# Altium project SE842170260.PRJPCB (part 1 of 2)
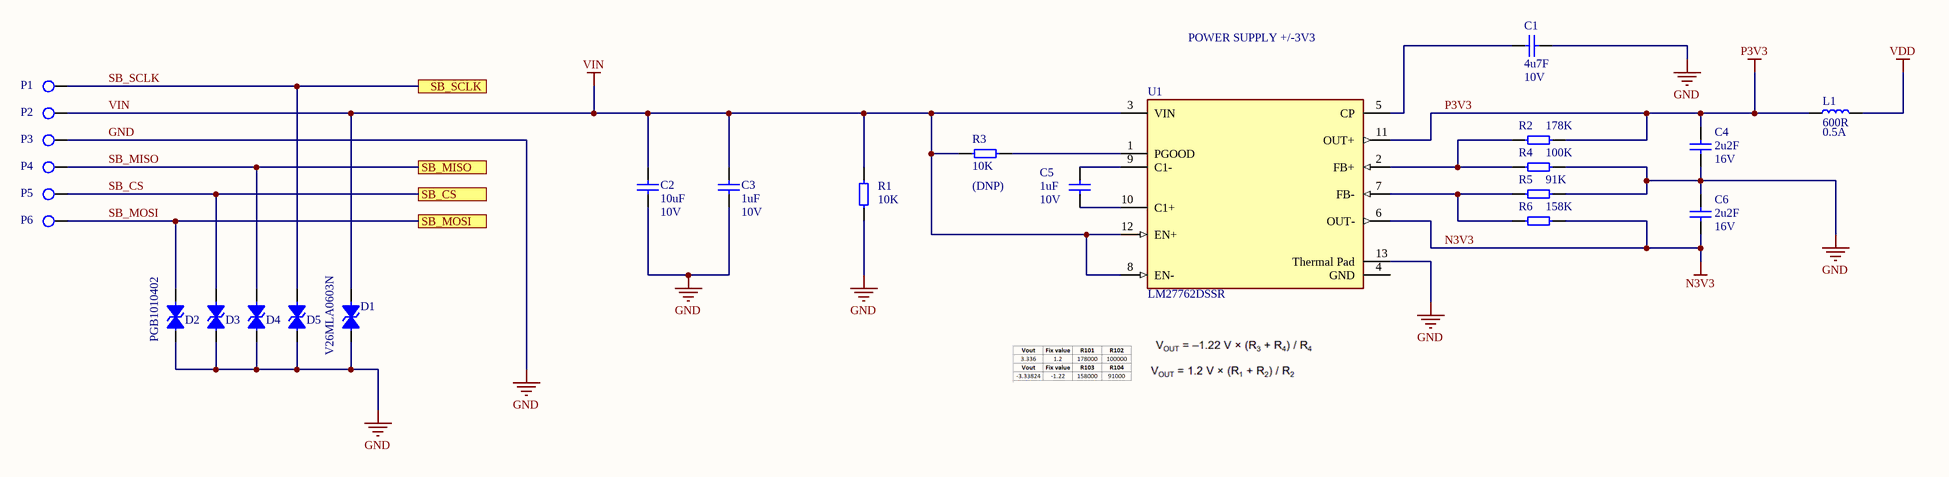
[diagram p0: CE842170260_SHEET1.SchDoc]
P_CircuitDiagramPartNumber: CE/YYYYY/ZZZZ; P_CircuitDiagramSafeFileName: CEYYYYYZZZZ; P_DesignedBy: Designer Name; P_DesignedDate: yyyy-mm-dd; P_Detail: Project Detai;; P_Mod: 1; P_Organization: Baker Hughes PPS; P_PCBAssemblyPartNumber: SE/YYYYY/ZZZZ; P_PCBAssemblySafeFileName: SEYYYYYZZZZ; P_PCBManufacturingPartNumber: DE/YYYYY/ZZZZ; P_PCBManufacturingSafeFileName: DEYYYYYZZZZ; P_Rev: 1; P_Title: Project Title
6 sheets, 204 parts. Net scope: flat (ports and power ports of the same name join across sheets).
Board file: DE842170260.PcbDoc
Sheets:
  CE842170260_SHEET1.SchDoc
  CE842170260_SHEET2.SchDoc
  CE842170260_SHEET3.SchDoc
  CE842170260_SHEET4.SchDoc
  CE842170260_SHEET5.SchDoc
  CE842170260_SHEET6.SchDoc

## Sheet CE842170260_SHEET1.SchDoc
size Tabloid; Revision: P; SheetNumber: 1; SheetTotal: 1; PageSetup: Record=PageOptions|CenterHorizontal=True|CenterVertical=True|PrintScale=0.75|XCorrection=1.00|YCorrection=1.00|PrintKind=0|BorderSize=5000000|LeftOffset=0|BottomOffset=0|Orientation=2|PaperLength=1000|PaperWidth=1000|Scale=100|PaperSource=7|PrintQuality=-4|MediaType=1|DitherType=10|PaperKind=A4|PrintScaleMode=1; Rule: PcbType=ProtelPcb

### Parts
C1  value 4u7F  Voltage: 10V  [C0603]  (hidden comment: KK/96159/2666)
C2  value 10uF  Voltage: 10V  [C0603]  (hidden comment: KK/96159/3701)
C3  value 1uF  Voltage: 10V  [C0603]  (hidden comment: KK/96159/2601)
C4  value 2u2F  Voltage: 16V  [C0603]  (hidden comment: KK/96159/3634)
C5  value 1uF  Voltage: 10V  [C0603]  (hidden comment: KK/96159/2601)
C6  value 2u2F  Voltage: 16V  [C0603]  (hidden comment: KK/96159/3634)
D1  MF_PartNumber: V26MLA0603N  [R0603]  (hidden comment: KK/95070/0035)
D2  MF_PartNumber: PGB1010402  [ESD0402]  (hidden comment: KK/95070/0036)
D3  KK/95070/0036  [ESD0402]  (value not drawn)
D4  KK/95070/0036  [ESD0402]  (value not drawn)
D5  KK/95070/0036  [ESD0402]  (value not drawn)
L1  value 600R  Power: 0.5A  [L0603]  (hidden comment: KK/97900/1033)
P1  TESTPAD1  [P0.8xH0.5]  (value not drawn)
P2  TESTPAD1  [P0.8xH0.5]  (value not drawn)
P3  TESTPAD1  [P0.8xH0.5]  (value not drawn)
P4  TESTPAD1  [P0.8xH0.5]  (value not drawn)
P5  TESTPAD1  [P0.8xH0.5]  (value not drawn)
P6  TESTPAD1  [P0.8xH0.5]  (value not drawn)
R1  value 10K  [R0603]  (hidden comment: KK/96059/0601)
R2  value 178K  [R0603]  (hidden comment: KK/96059/0725)
R3  value 10K  [R0603]  (hidden comment: KK/96059/0601)
R4  value 100K  [R0603]  (hidden comment: KK/96059/0701)
R5  value 91K  [R0603]  (hidden comment: KK/96059/1693)
R6  value 158K  [R0603]  (hidden comment: KK/96059/0720)
U1  MF_PartNumber: LM27762DSSR  [WSON-12]  (hidden comment: KK/95311/0117)

### Ports
SB_CS, SB_MISO, SB_MOSI, SB_SCLK

### Nets
GND: C1.2 C2.2 C3.2 C4.2 C6.1 D1.1 D2.1 D3.1 D4.1 D5.1 P3.1 R1.2 R4.2 R5.2 U1.13(Thermal_Pad)
N3V3: C6.2 R6.2 U1.6(OUT-)
P3V3: C4.1 L1.1 R2.2 U1.11(OUT+)
SB_SCLK: C2.1 C3.1 D1.2 D5.2 P1.1 P2.1 R1.1 R3.1 U1.3(VIN) U1.8(EN-) U1.12(EN+) ; port SB_SCLK  [also labelled VIN]
VDD: L1.2
SB_CS: D3.2 P5.1 ; port SB_CS
SB_MISO: D4.2 P4.1 ; port SB_MISO
SB_MOSI: D2.2 P6.1 ; port SB_MOSI
NetC1_1: C1.1 U1.5(CP)
NetC5_1: C5.1 U1.9(C1-)
NetC5_2: C5.2 U1.10(C1+)
NetR2_1: R2.1 R4.1 U1.2(FB+)
NetR3_2: R3.2 U1.1(PGOOD)
NetR5_1: R5.1 R6.1 U1.7(FB-)

Not connected (* = marked no-connect by the designer): U1 4(GND)

### Notes on the sheet
- POWER SUPPLY +/-3V3
- (near R3) (DNP)
- Title:
- Designed:
- Date:
- PROPRIETARY & CONFIDENTIAL
- DO NOT COPY, WHOLE OR IN PART.
- Detail:
- Number:
- Rev:
- Checked:
- DO NOT DISTRIBUTE WITHOUT WRITTEN CONSENT.
- File:
- Sheet:
- of
- Approved:

### Library data of the parts
C1 = KK/96159/2666: CAPACITOR_4u7F_10%_10V_0603; ID: 165; Tolerance: 10%; PII_PartNumber: KK/96159/2666; Pins: 2
C2 = KK/96159/3701: CAPACITOR_10uF_10%_10V_0603; ID: 175; Tolerance: 10%; PII_PartNumber: KK/96159/3701; Pins: 2
C3 C5 = KK/96159/2601: CAPACITOR_1uF_+10%_10V_603; ID: 164; Tolerance: 10%; PII_PartNumber: KK/96159/2601; Pins: 2
C4 C6 = KK/96159/3634: CAPACITOR CERAMIC 0603 16V 10% X5R 2u2; ID: 569; PII_PartNumber: KK/96159/3634; Pins: 2; Tolerance: 10%
D1 = KK/95070/0035: TVS,SMD,LITTLEFUSE,V26MLA0603N[20-26V]; ID: 261; Voltage: 26V; Value: 34.5V; PII_PartNumber: KK/95070/0035; Pins: 2; Manufacturer: LITTLEFUSE; Temperature: -55°C +125°C
D2-D5 = KK/95070/0036: SUPPRESSOR ESD,SMD,0402,12VDC,LIF,PGB1010402; Manufacturer: LITTELFUSE; ID: 262; Voltage: 12V; PII_PartNumber: KK/95070/0036; Pins: 2
  D3-D5: MF_PartNumber: PGB1010402
L1 = KK/97900/1033: FERRIT BEADS 0603 600R 0.5A 25%; MF_PartNumber: 742863160; Manufacturer: WUERTH; ID: 158; PII_PartNumber: KK/97900/1033; Pins: 2; Tolerance: 25%; Temperature: -55 to +125C
P1-P6 = TESTPAD1: P0.8 X H0.5 X 0.9SM; Manufacturer: PCB MANUFACTURER; ID: 26; PII_PartNumber: TESTPAD1; MF_PartNumber: P0.8 X H0.5 X 0.9SM; Pins: 1
R1 R3 = KK/96059/0601: RESISTOR_10K_1%_0603J_63mW; ID: 1090; Tolerance: 1%; Power: 63mW; PII_PartNumber: KK/96059/0601; Pins: 2
R2 = KK/96059/0725: RESISTOR 0603 0.063W 0.1% 178K; ID: 1402; PII_PartNumber: KK/96059/0725; Pins: 2; Tolerance: 0.1%; Power: 0.063W
R4 = KK/96059/0701: RESISTOR_100K_1%_0603J_63mW; ID: 1111; Tolerance: 1%; Power: 63mW; PII_PartNumber: KK/96059/0701; Pins: 2
R5 = KK/96059/1693: RESISTOR 0603 0.063W 1% 91K; ID: 1396; PII_PartNumber: KK/96059/1693; Pins: 2; Tolerance: 1%; Power: 0.063W
R6 = KK/96059/0720: RESISTOR_158K_1%_0603J_63mW; ID: 1118; Tolerance: 1%; Power: 63mW; PII_PartNumber: KK/96059/0720; Pins: 2
U1 = KK/95311/0117: SWITCHING REGULATOR; Manufacturer: TEXAS INSTRUMENTS; Topology: Charge Pump; Min Output Voltage: 1.5V; Max Input Voltage: 5.5V; Synchronous Rectifier: No; Output Type: Adjustable; Output Current: 250mA; Min Input Voltage: 2.7V; Quiescent Current: 390uA; Switching Frequency: 2.3MHz; Max Output Voltage: 5V; ID: 104; Voltage: 2.7-5.5V; Lead Free: Lead Free; Min Operating Temperature: -40°C; Max Operating Temperature: 85°C; RoHS Compliant: Yes; Packaging: Tape and Reel; Mount: Surface Mount; Manufacturer Part Number: LM27762DSSR; PII_PartNumber: KK/95311/0117; Pins: 12; Power: 250mA; Temperature: -40 to +85C

## Sheet CE842170260_SHEET2.SchDoc
size Tabloid; Revision: P; SheetNumber: 1; SheetTotal: 1; PageSetup: Record=PageOptions|CenterHorizontal=True|CenterVertical=True|PrintScale=0.75|XCorrection=1.00|YCorrection=1.00|PrintKind=0|BorderSize=5000000|LeftOffset=0|BottomOffset=0|Orientation=2|PaperLength=1000|PaperWidth=1000|Scale=100|PaperSource=7|PrintQuality=-4|MediaType=1|DitherType=10|PaperKind=A4|PrintScaleMode=1; Rule: PcbType=ProtelPcb
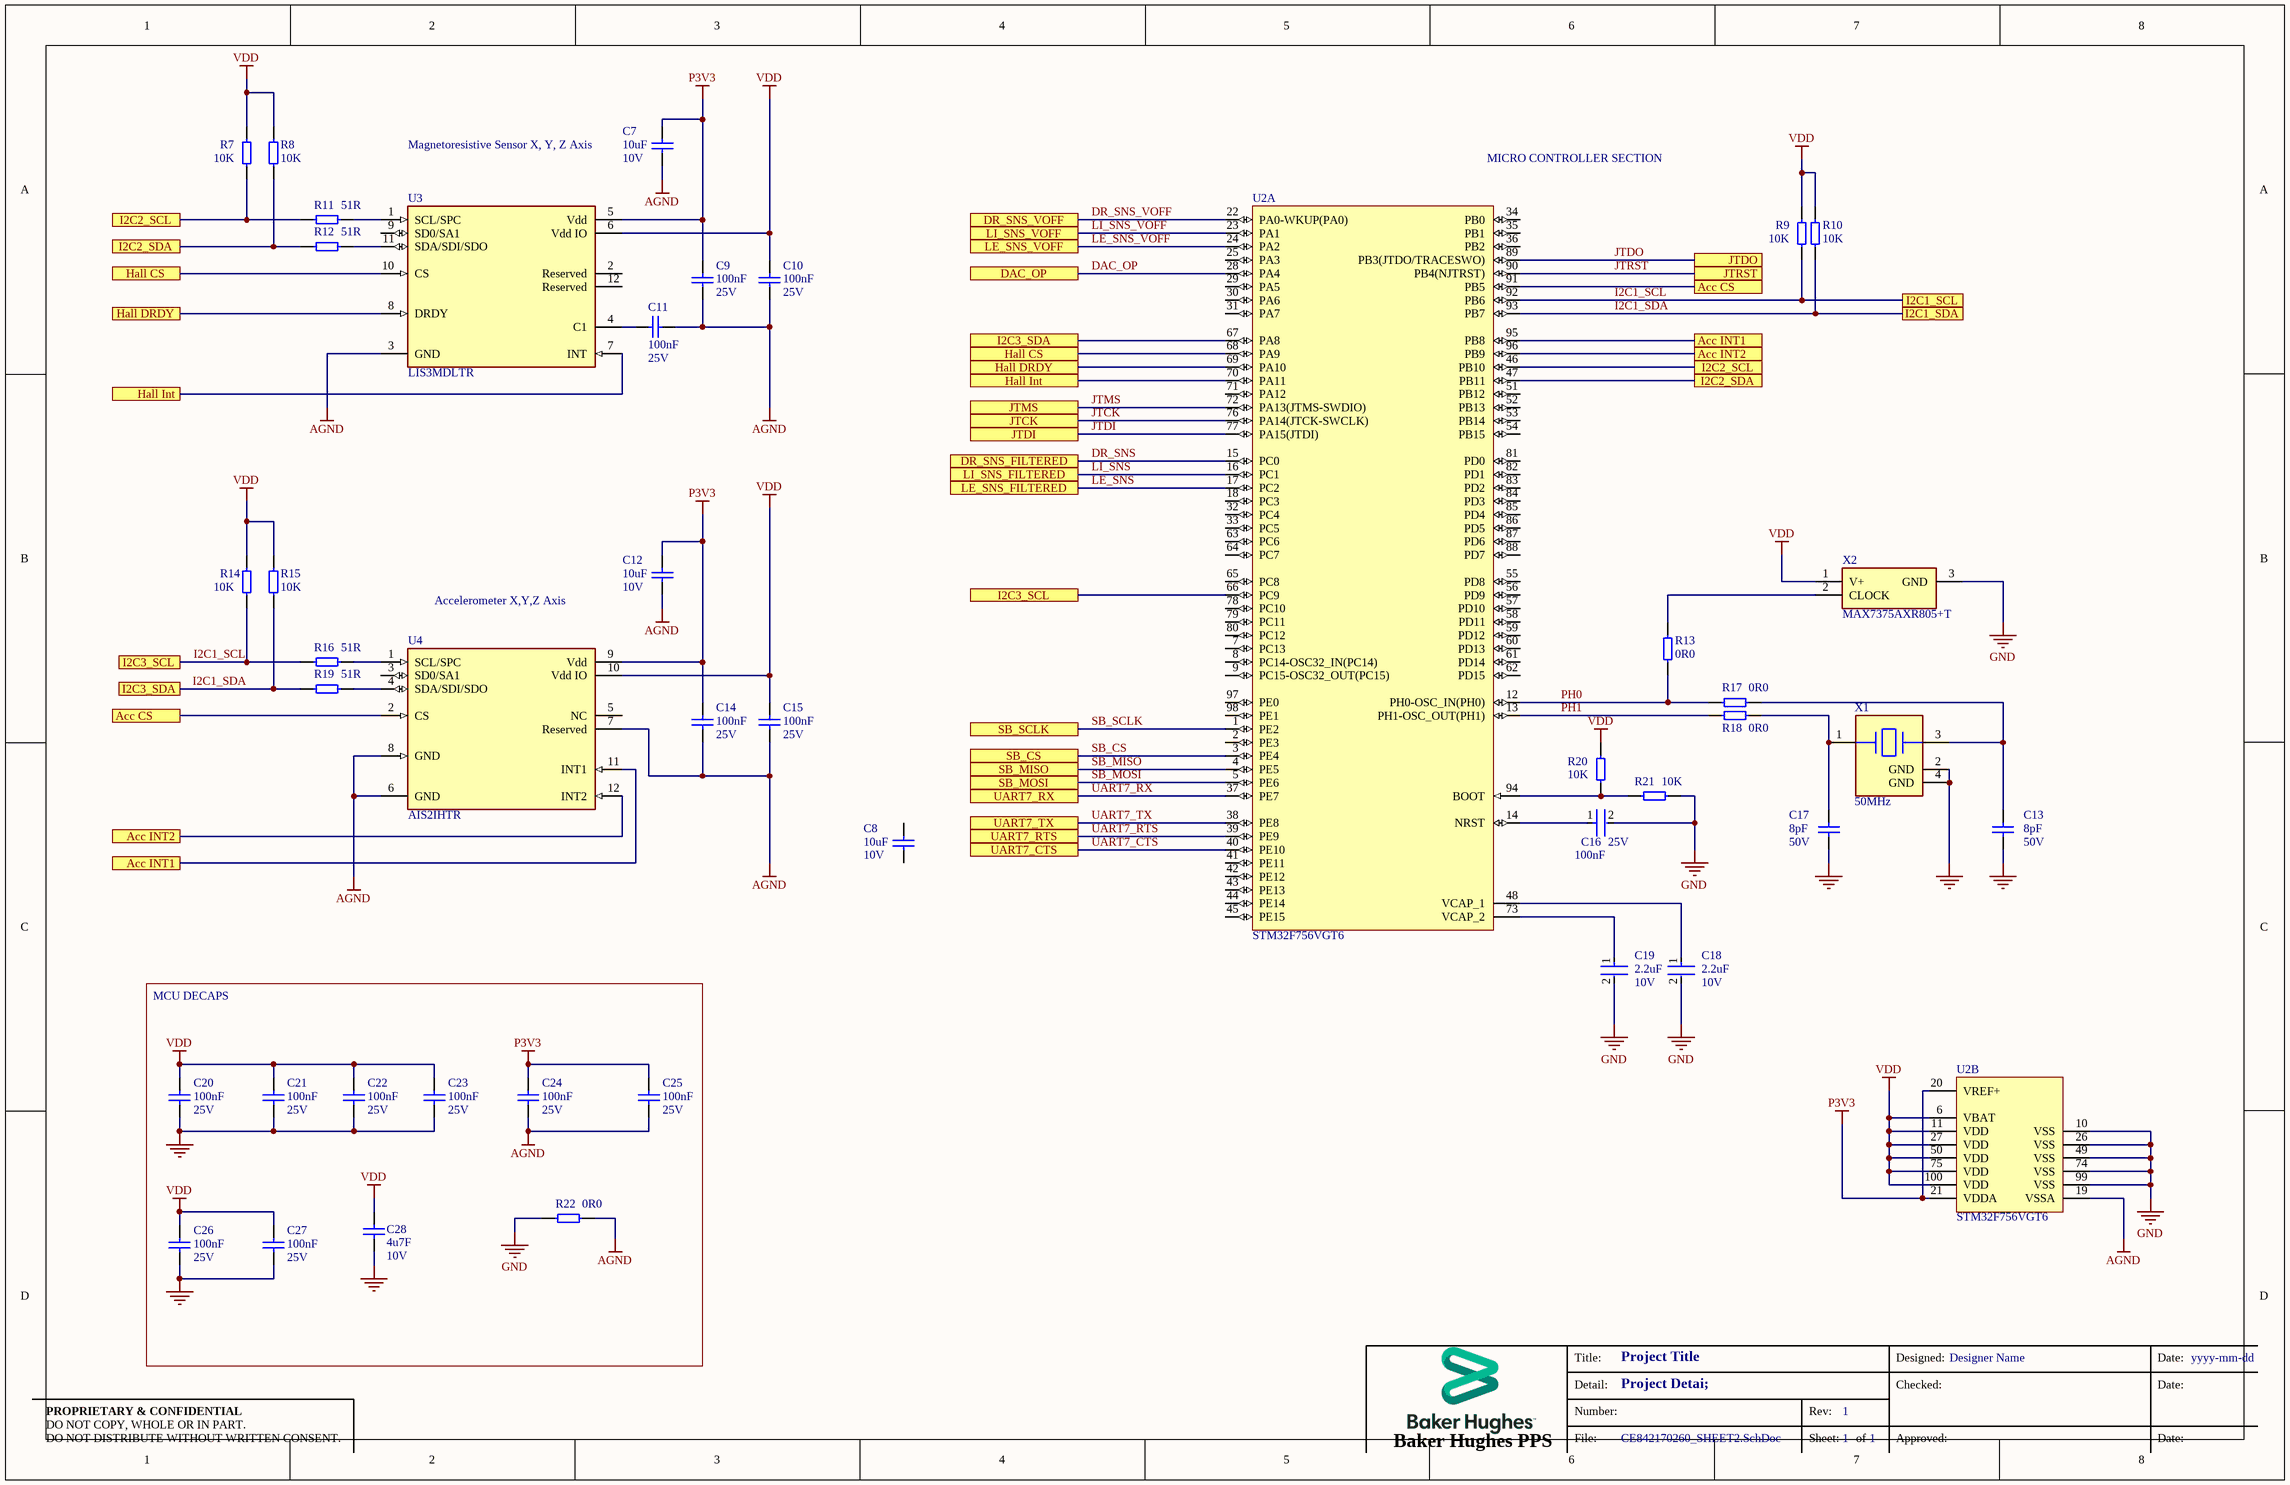
[diagram p1: CE842170260_SHEET2.SchDoc]

### Parts
C7  value 10uF  Voltage: 10V  [C0603]  (hidden comment: KK/96159/3701)
C8  value 10uF  Voltage: 10V  [C0603]  (hidden comment: KK/96159/3701)
C9  value 100nF  Voltage: 25V  [C0603]  (hidden comment: KK/96159/4501)
C10  value 100nF  Voltage: 25V  [C0603]  (hidden comment: KK/96159/4501)
C11  value 100nF  Voltage: 25V  [C0603]  (hidden comment: KK/96159/4501)
C12  value 10uF  Voltage: 10V  [C0603]  (hidden comment: KK/96159/3701)
C13  value 8pF  Voltage: 50V  [C0603]  (hidden comment: KK/96159/0088)
C14  value 100nF  Voltage: 25V  [C0603]  (hidden comment: KK/96159/4501)
C15  value 100nF  Voltage: 25V  [C0603]  (hidden comment: KK/96159/4501)
C16  Voltage Rating (DC): 25V  Capacitance: 100nF  [FP-C1005-050-0_05-MFG]  (hidden comment: C1005X5R1E104K050BC)
C17  value 8pF  Voltage: 50V  [C0603]  (hidden comment: KK/96159/0088)
C18  Voltage Rating: 10V  Capacitance: 2.2uF  [FP-CGB3B-IPC_A]  (hidden comment: CGB3B3X5R1A225M055AB)
C19  Voltage Rating: 10V  Capacitance: 2.2uF  [FP-CGB3B-IPC_A]  (hidden comment: CGB3B3X5R1A225M055AB)
C20  value 100nF  Voltage: 25V  [C0603]  (hidden comment: KK/96159/4501)
C21  value 100nF  Voltage: 25V  [C0603]  (hidden comment: KK/96159/4501)
C22  value 100nF  Voltage: 25V  [C0603]  (hidden comment: KK/96159/4501)
C23  value 100nF  Voltage: 25V  [C0603]  (hidden comment: KK/96159/4501)
C24  value 100nF  Voltage: 25V  [C0603]  (hidden comment: KK/96159/4501)
C25  value 100nF  Voltage: 25V  [C0603]  (hidden comment: KK/96159/4501)
C26  value 100nF  Voltage: 25V  [C0603]  (hidden comment: KK/96159/4501)
C27  value 100nF  Voltage: 25V  [C0603]  (hidden comment: KK/96159/4501)
C28  value 4u7F  Voltage: 10V  [C0603]  (hidden comment: KK/96159/2666)
R7  value 10K  [R0603]  (hidden comment: KK/96059/0601)
R8  value 10K  [R0603]  (hidden comment: KK/96059/0601)
R9  value 10K  [R0603]  (hidden comment: KK/96059/0601)
R10  value 10K  [R0603]  (hidden comment: KK/96059/0601)
R11  value 51R  [R0603]  (hidden comment: KK/96059/1369)
R12  value 51R  [R0603]  (hidden comment: KK/96059/1369)
R13  value 0R0  [R0603]  (hidden comment: KK/96059/0000)
R14  value 10K  [R0603]  (hidden comment: KK/96059/0601)
R15  value 10K  [R0603]  (hidden comment: KK/96059/0601)
R16  value 51R  [R0603]  (hidden comment: KK/96059/1369)
R17  value 0R0  [R0603]  (hidden comment: KK/96059/0000)
R18  value 0R0  [R0603]  (hidden comment: KK/96059/0000)
R19  value 51R  [R0603]  (hidden comment: KK/96059/1369)
R20  value 10K  [R0603]  (hidden comment: KK/96059/0601)
R21  value 10K  [R0603]  (hidden comment: KK/96059/0601)
R22  value 0R0  [R0603]  (hidden comment: KK/96059/0000)
U2  MF_PartNumber: STM32F756VGT6  [LQFP-100]  (hidden comment: KK/95414/0147)  (parts A,B of 2)
U3  MF_PartNumber: LIS3MDLTR  [LGA-12]  (hidden comment: KK/95312/0195)
U4  MF_PartNumber: AIS2IHTR  [LGA-12]  (hidden comment: KK/95312/0196)
X1  Frequency: 50MHz  [FP-NX1612SA-MFG]  (hidden comment: NX1612SA-50M-EXS00A-CS08403)
X2  MAX7375AXR805+T  [SOT65P210X110-3N]

### Blocks framed on the sheet
MCU DECAPS: C20-C28 R22

### Ports
Acc CS, Acc INT1, Acc INT2, DAC_OP, DR_SNS_FILTERED, DR_SNS_VOFF, Hall CS, Hall DRDY, Hall Int, I2C1_SCL, I2C1_SDA, I2C2_SCL, I2C2_SDA, I2C3_SCL, I2C3_SDA, JTCK, JTDI, JTDO, JTMS, JTRST, LE_SNS_FILTERED, LE_SNS_VOFF, LI_SNS_FILTERED, LI_SNS_VOFF, SB_CS, SB_MISO, SB_MOSI, SB_SCLK, UART7_CTS, UART7_RTS, UART7_RX, UART7_TX

### Nets
AGND: C7.2 C9.2 C10.2 C11.2 C12.2 C14.2 C15.2 C24.2 C25.2 R22.2 U2.19(VSSA) U3.3(GND) U4.6(GND) U4.7(Reserved) U4.8(GND)
GND: C13.1 C16.2 C17.2 C18.2 C19.2 C20.2 C21.2 C22.2 C23.2 C26.2 C27.2 C28.2 R21.1 R22.1 U2.10(VSS) U2.26(VSS) U2.49(VSS) U2.74(VSS) U2.99(VSS) X1.2(GND) X1.4(GND) X2.3(GND)
P3V3: C7.1 C9.1 C12.1 C14.1 C24.1 C25.1 U2.20(VREF+) U2.21(VDDA) U3.5(Vdd) U4.9(Vdd)
SB_SCLK: U2.1(PE2) ; port SB_SCLK
VDD: C10.1 C15.1 C20.1 C21.1 C22.1 C23.1 C26.1 C27.1 C28.1 R7.2 R8.2 R9.2 R10.2 R14.2 R15.2 R20.2 U2.6(VBAT) U2.11(VDD) U2.27(VDD) U2.50(VDD) U2.75(VDD) U2.100(VDD) U3.6(Vdd_IO) U4.10(Vdd_IO) X2.1(V+)
DAC_OP: R10.1 R15.1 R19.1 U2.28(PA4) U2.67(PA8) U2.91(PB5) U2.93(PB7) U4.2(CS) ; port DAC_OP, port I2C1_SDA, port Acc CS, port I2C3_SDA  [also labelled I2C1_SDA]  [project net DAC OP]
DR_SNS: U2.15(PC0) ; port DR_SNS_FILTERED
DR_SNS_VOFF: R7.1 R11.1 U2.22(PA0-WKUP(PA0)) U2.46(PB10) ; port DR_SNS_VOFF, port I2C2_SCL
I2C1_SCL: R9.1 R14.1 R16.1 U2.66(PC9) U2.92(PB6) ; port I2C1_SCL, port I2C3_SCL  [project net DR_SNS]
JTCK: U2.76(PA14(JTCK-SWCLK)) ; port JTCK
JTDI: U2.77(PA15(JTDI)) ; port JTDI
JTDO: U2.89(PB3(JTDO/TRACESWO)) ; port JTDO
JTMS: U2.72(PA13(JTMS-SWDIO)) ; port JTMS
JTRST: U2.90(PB4(NJTRST)) ; port JTRST
LE_SNS: U2.68(PA9) U3.10(CS) ; port Hall CS
LE_SNS: U2.17(PC2) ; port LE_SNS_FILTERED  [a separate net that carries the same name]
LE_SNS_VOFF: R8.1 R12.1 U2.24(PA2) U2.47(PB11) ; port LE_SNS_VOFF, port I2C2_SDA
LI_SNS: U2.16(PC1) ; port LI_SNS_FILTERED
LI_SNS_VOFF: U2.23(PA1) U2.69(PA10) U3.8(DRDY) ; port LI_SNS_VOFF, port Hall DRDY
PH0: R13.2 R17.1 U2.12(PH0-OSC_IN(PH0))
PH1: R18.1 U2.13(PH1-OSC_OUT(PH1))
SB_CS: U2.3(PE4) ; port SB_CS
SB_MISO: U2.4(PE5) ; port SB_MISO
SB_MOSI: U2.5(PE6) ; port SB_MOSI
UART7_CTS: U2.40(PE10) ; port UART7_CTS
UART7_RTS: U2.39(PE9) ; port UART7_RTS
UART7_RX: U2.37(PE7) ; port UART7_RX
UART7_TX: U2.38(PE8) ; port UART7_TX
NetC11_1: C11.1 U3.4(C1)
NetC13_2: C13.2 R17.2 X1.3(2_Xtal)
NetC16_1: C16.1 U2.14(NRST)
NetC17_1: C17.1 R18.2 X1.1(1_Xtal)
NetC18_1: C18.1 U2.48(VCAP_1)
NetC19_1: C19.1 U2.73(VCAP_2)
NetJ8_5: U2.70(PA11) U3.7(INT) ; port Hall Int
NetJ10_4: U2.95(PB8) U4.11(INT1) ; port Acc INT1
NetJ10_5: U2.96(PB9) U4.12(INT2) ; port Acc INT2
NetR11_2: R11.2 U3.1(SCL/SPC)
NetR12_2: R12.2 U3.11(SDA/SDI/SDO)
NetR13_1: R13.1 X2.2(CLOCK)
NetR16_2: R16.2 U4.1(SCL/SPC)
NetR19_2: R19.2 U4.4(SDA/SDI/SDO)
NetR20_1: R20.1 R21.2 U2.94(BOOT)

Not connected (* = marked no-connect by the designer): C8 1 2; U2 2(PE3) 7(PC13) 8(PC14-OSC32_IN(PC14)) 9(PC15-OSC32_OUT(PC15)) 18(PC3) 25(PA3) 29(PA5) 30(PA6) 31(PA7) 32(PC4) 33(PC5) 34(PB0) 35(PB1) 36(PB2) 41(PE11) 42(PE12) 43(PE13) 44(PE14) 45(PE15) 51(PB12) 52(PB13) 53(PB14) 54(PB15) 55(PD8) 56(PD9) 57(PD10) 58(PD11) 59(PD12) 60(PD13) 61(PD14) 62(PD15) 63(PC6) 64(PC7) 65(PC8) 71(PA12) 78(PC10) 79(PC11) 80(PC12) 81(PD0) 82(PD1) 83(PD2) 84(PD3) 85(PD4) 86(PD5) 87(PD6) 88(PD7) 97(PE0) 98(PE1); U3 2(Reserved) 9(SD0/SA1) 12(Reserved); U4 3(SD0/SA1) 5(NC)

### Notes on the sheet
- (near C7) Magnetoresistive Sensor X, Y, Z Axis
- MICRO CONTROLLER SECTION
- Accelerometer X,Y,Z Axis
- Title:
- Designed:
- Date:
- PROPRIETARY & CONFIDENTIAL
- DO NOT COPY, WHOLE OR IN PART.
- Detail:
- Number:
- Rev:
- Checked:
- DO NOT DISTRIBUTE WITHOUT WRITTEN CONSENT.
- File:
- Sheet:
- of
- Approved:

### Library data of the parts
C7 C8 C12 = KK/96159/3701: as C2 on sheet CE842170260_SHEET1; PII_PartNumber: KK/96159/3701; Pins: 2
C9-C11 C14 C15 C20-C27 = KK/96159/4501: CAPACITOR_100nF_+10%_25V_603; ID: 185; Tolerance: 10%; PII_PartNumber: KK/96159/4501; Pins: 2
C13 C17 = KK/96159/0088: CAPACITOR CERAMIC 0603 50V 5% NPO 8pF; ID: 570; PII_PartNumber: KK/96159/0088; Pins: 2; Tolerance: 5%
C16 = CMP-2000-06000-2: Multilayer Ceramic Capacitors 100nF ±10% 25V X5R SMD 0402; Case Code (Imperial): 0402; Termination: Wraparound; Series: C; Depth: 0.5mm; Contact Plating: Tin; Case Code (Metric): 1005; Dielectric: X5R; Case/Package: 0402; Voltage Rating: 25V; Packaging: Tape and Reel; Thickness: 0.022inch; Dielectric Material: Ceramic; Height: 0.5mm; Weight: 2.3E-05oz; RoHS Compliant: Yes; Width: 0.02inch; Tolerance: 10%; Mount: Surface Mount; Package Quantity: 1; Max Operating Temperature: 85°C; Construction: Flat; Min Operating Temperature: -55°C; REACH SVHC: No SVHC; Resistor Type: Ceramic; Length: 1mm; Lead Free: Lead Free; Voltage: 25V
C18 C19 = CMP-08246-006382-1: Multilayer Ceramic Capacitors 2.2uF ±20% 10V X5R SMD 0603; Max Operating Temperature: 85°C; Length: 1.6mm; Case Code (Imperial): 0603; Termination: SMD/SMT; Weight: 7.1E-05oz; Mount: Surface Mount; Depth: 0.8mm; Packaging: Tape and Reel; RoHS Compliant: Yes; Series: CGB; Voltage Rating (DC): 10V; Dielectric: X5R; Case/Package: 0603; Case Code (Metric): 1608; Height: 0.55mm; Min Operating Temperature: -55°C; Thickness: 0.022inch; Tolerance: 20%; Width: 0.8mm; Package Quantity: 1; Lead Free: Lead Free
C28 = KK/96159/2666: as C1 on sheet CE842170260_SHEET1; PII_PartNumber: KK/96159/2666; Pins: 2
R7-R10 R14 R15 R20 R21 = KK/96059/0601: as R1 on sheet CE842170260_SHEET1; PII_PartNumber: KK/96059/0601; Pins: 2
R11 R12 R16 R19 = KK/96059/1369: RESISTOR_51R_1%_0603J_63mW; ID: 1148; Tolerance: 1%; Power: 63mW; Temp_Coeff: 100ppm; PII_PartNumber: KK/96059/1369; Pins: 2
R13 R17 R18 R22 = KK/96059/0000: ZERO OHM LINK; ID: 7; Power: 63mW; PII_PartNumber: KK/96059/0000; Pins: 2
U2 = KK/95414/0147: MICROCONTROLLER MCU; Manufacturer: STMICROELECTRONICS; Manufacturer Part Number: STM32F756VGT6U; D/A Converter: 2; I/Os (High Current): 82; Core: ARM Cortex-M7; Packing: Tray; Supply Voltage(Vcc) min (V): 1.7; Operating Frequency(F) (Processor speed) (MHz): 216; Internal RAM Size (kB): 320; FLASH Size (Prog) (kB): 1024; ID: 81; Value: 1MB/32BIT; Voltage: 1.7-3.6V; ComponentLink2Description: Datasheet; DatasheetVersion: Rev. 4; ComponentLink1URL: http://www.st.com/; Package Description: 100-Pin Low Profile Quad Flat Package, Body 14 x 14 mm, Pitch 0.5 mm; ComponentLink1Description: Manufacturer URL; Mounting Technology: Surface Mount; ComponentLink2URL: http://www.st.com/st-web-ui/static/active/en/resource/technical/document/datasheet/DM00166114.pdf; Package Reference: LQFP100; Manufacturer Part Number: STM32F756VGT6; Manufacturer: STMicroelectronics; PII_PartNumber: KK/95414/0147; Pins: 100; Temperature: -40 to +85C
U3 = KK/95312/0195: 3 AXIS MAGNETIC SENSOR; Manufacturer: STMicroelectronics; Sensor Output: I2C,SPI; Operating Supply Current: 40-270uA; Max Supply Voltage: 3.6V; Min Supply Voltage: 1.71V; ID: 103; Voltage: 1.9 - 3.6V; ComponentLink2URL: https://www.st.com/resource/en/datasheet/lis3mdl.pdf; Category: IC; Manufacturer Part Number: LIS3MDLTR; Octopart: https://octopart.com/lis3mdltr-stmicroelectronics-29403125; Automotive: No; Sensing Method: Magnetic; ComponentLink2Description: Datasheet; RoHS: TRUE; Device Class L3: unset; Device Class L1: Sensors; Temperature: -40 to +85C; Height: 1mm; Mouser Description: Board Mount Hall Effect / Magnetic Sensors Ultra Lo-Pwr Hi Perf 3-Axis 1.9-3.6V; Temperature Range High: +85°C; Lead Free: Yes; Device Class L2: Magnetic Sensors; Footprint Url: https://www.st.com/content/ccc/resource/technical/document/technical_note/73/17/9c/16/dd/96/4a/01/CD00134799.pdf/files/CD00134799.pdf/jcr:content/translations/en.CD00134799.pdf; Temperature Range Low: -40°C; Package: VFLGA-12-8365767; Digikey Description: SENSOR MR I2C/SPI 12LGA; PII_PartNumber: KK/95312/0195; Pins: 12
U4 = KK/95312/0196: 3 AXIS DIGITAL ACCELEROMETER 14BIT; Manufacturer: STMicroelectronics; Sensor Output: I2C,SPI; Operating Supply Current: 0.67-110uA; Max Supply Voltage: 3.6V; Sensing Method: X,Y,Z; Min Supply Voltage: 1.62V; ID: 102; Voltage: 1.62 - 3.6V; ComponentLink2URL: https://www.st.com/resource/en/datasheet/lis3mdl.pdf; Category: IC; Octopart: https://www.mouser.co.uk/datasheet/2/389/dm00462829-2042226.pdf; Automotive: YES; ComponentLink2Description: Datasheet; RoHS: TRUE; Device Class L3: unset; Device Class L1: Sensors; Temperature: -40 to +115C; Height: 1mm; Mouser Description: Board Mount Hall Effect / Magnetic Sensors Ultra Lo-Pwr Hi Perf 3-Axis 1.9-3.6V; Temperature Range High: +85°C; Lead Free: Yes; Device Class L2: Magnetic Sensors; Footprint Url: https://www.st.com/content/ccc/resource/technical/document/technical_note/73/17/9c/16/dd/96/4a/01/CD00134799.pdf/files/CD00134799.pdf/jcr:content/translations/en.CD00134799.pdf; Temperature Range Low: -40°C; Package: VFLGA-12-8365767; Digikey Description: SENSOR MR I2C/SPI 12LGA; PII_PartNumber: KK/95312/0196; Pins: 12
X1 = CMP-200220-000009-1: CRYSTAL 50MHZ 8PF SMD; ESR (Equivalent Series Resistance): 80R; Frequency Stability: 15ppm; Frequency Tolerance: 10ppm; Case/Package: SMD/SMT; Min Operating Temperature: -30°C; Packaging: Cut Tape; Max Operating Temperature: 85°C; Mount: Surface Mount; Load Capacitance: 8pF
X2 = MAX7375AXR805+T: MAXIM INTEGRATED PRODUCTS - MAX7375AXR805+T - OSCILLATOR, 8MHZ, 5.5V, SC-70-3; Manufacturer_Name: Analog Devices; Geometry.Height: 1.1mm; Manufacturer_Part_Number: MAX7375AXR805+T; Mouser Part Number: 700-MAX7375AXR805+T; Mouser Price/Stock: https://www.mouser.co.uk/ProductDetail/Maxim-Integrated/MAX7375AXR805%2bT?qs=1eQvB6Dk1vjChWERGxp2Mg%3D%3D; Arrow Part Number: MAX7375AXR805+T; Arrow Price/Stock: https://www.arrow.com/en/products/max7375axr805t/maxim-integrated?region=nac; Mouser Testing Part Number: *; Mouser Testing Price/Stock: *; Datasheet Link: https://datasheets.maximintegrated.com/en/ds/MAX7375.pdf

## Sheet CE842170260_SHEET3.SchDoc
size Tabloid; SheetNumber: 4; SheetTotal: 4; PageSetup: Record=PageOptions|CenterHorizontal=True|CenterVertical=True|PrintScale=0.70|XCorrection=1.00|YCorrection=1.00|PrintKind=1|BorderSize=5000000|LeftOffset=0|BottomOffset=0|Orientation=2|PaperLength=1000|PaperWidth=1000|Scale=100|PaperSource=7|PrintQuality=-4|MediaType=1|DitherType=10|PaperKind=8 1/2x11|PrintScaleMode=1; SPICEModelCacheMIYJXAQF: <root> / <DocumentId>MIYJXAQF</DocumentId> / </root>
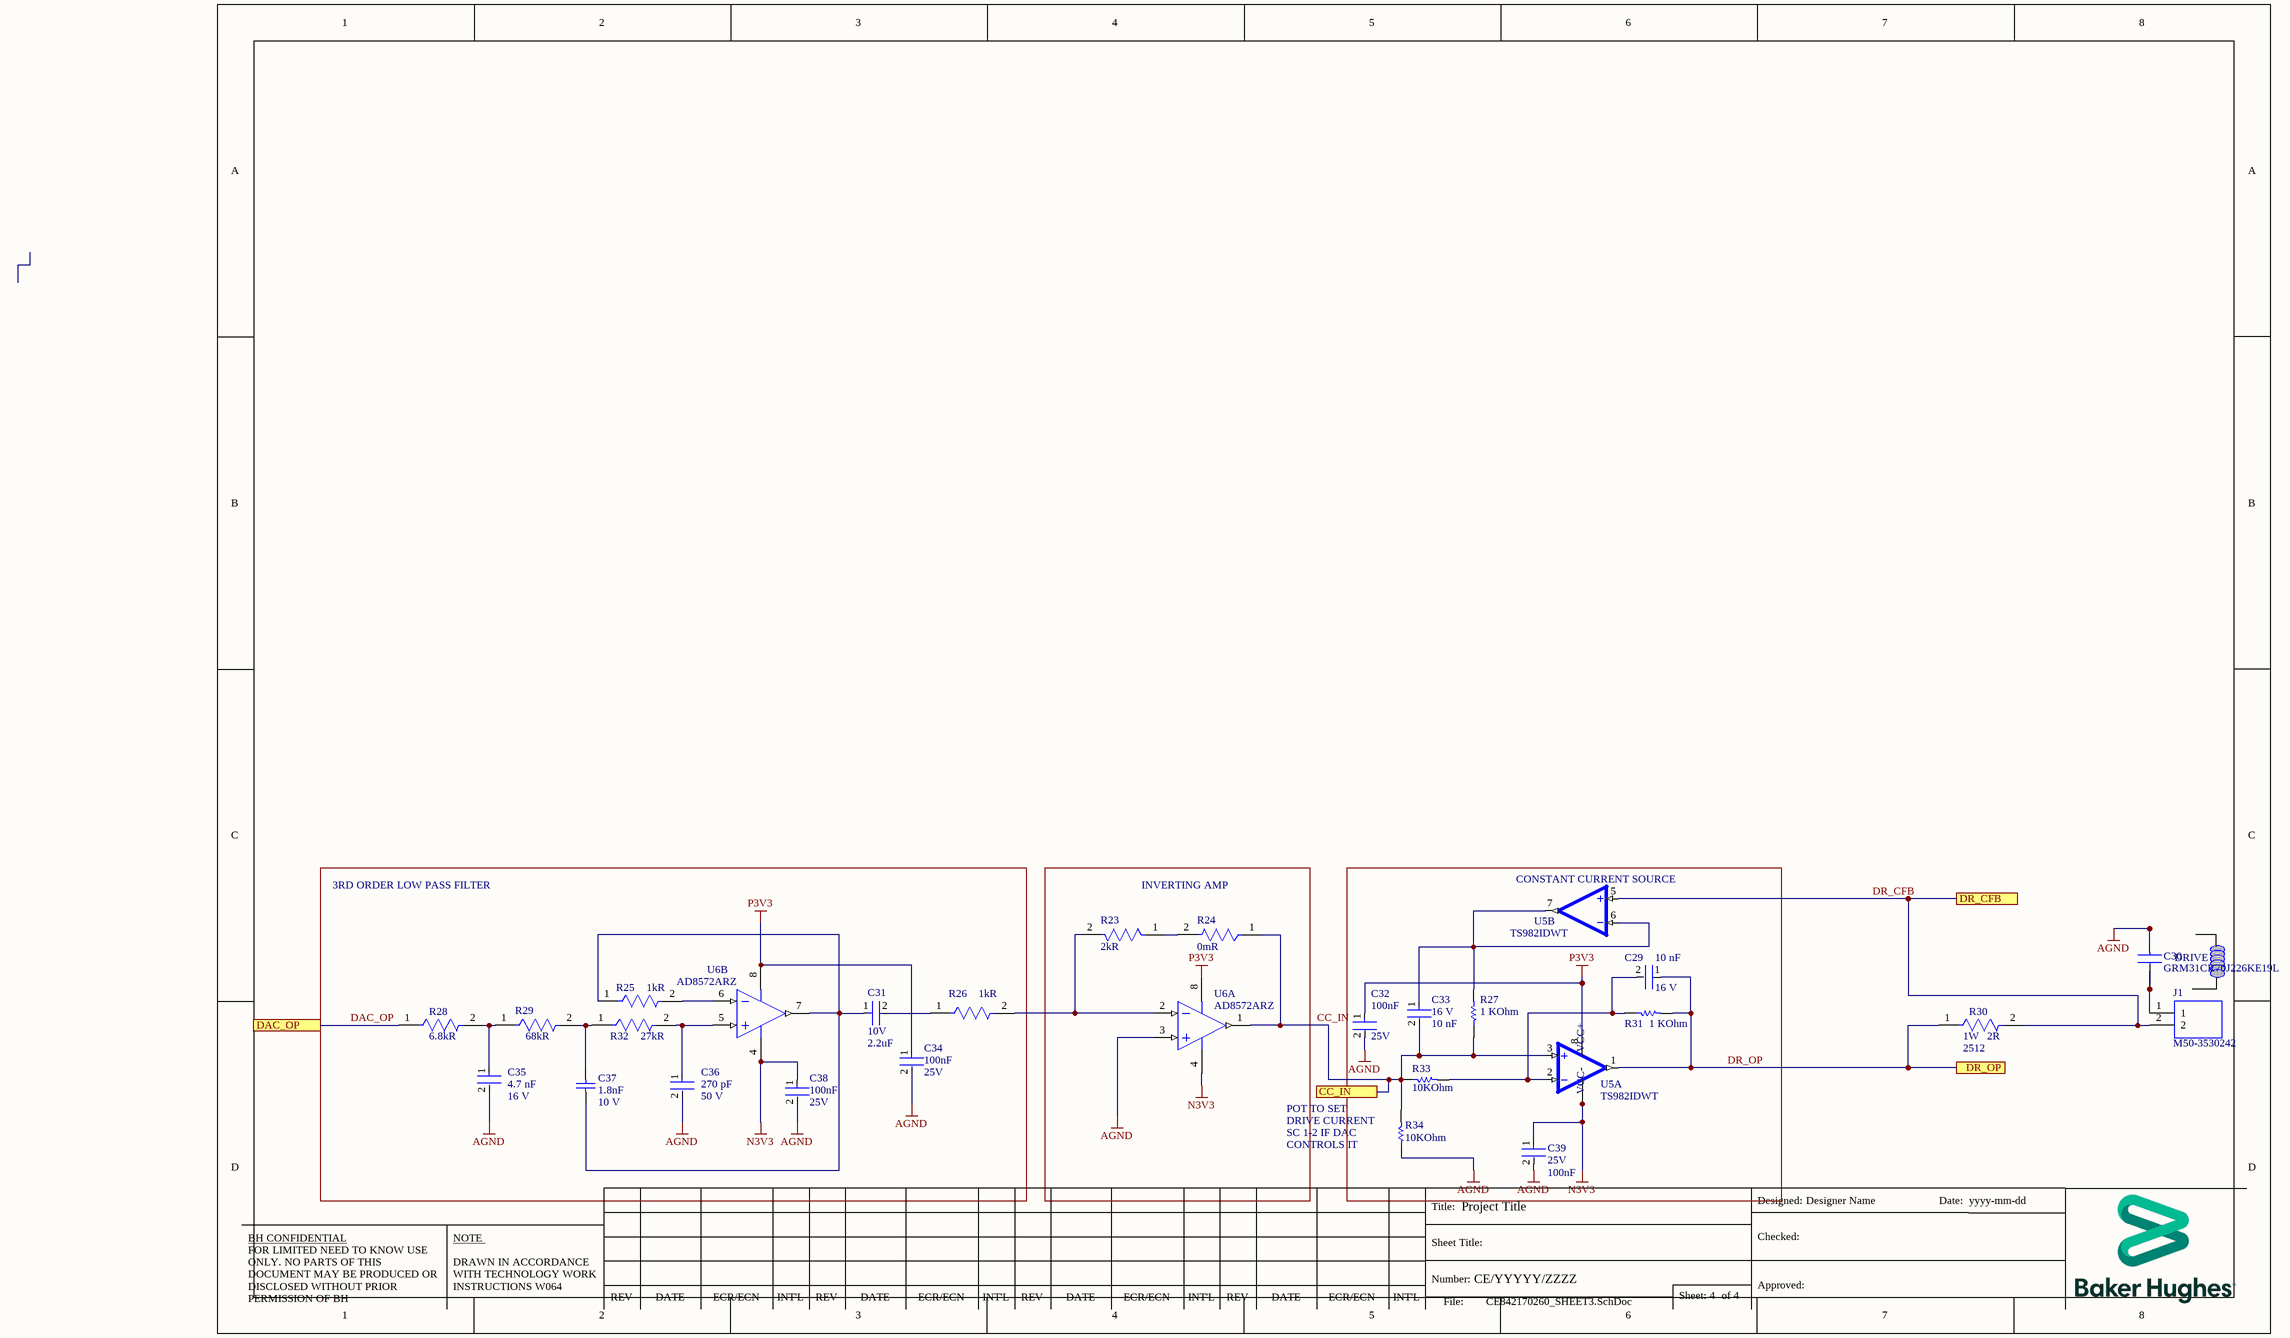
[diagram p2: CE842170260_SHEET3.SchDoc]

### Parts
C29  Capacitance: 10 nF  Voltage Rating: 16 V  [FP-CC0402-MFG]  (hidden comment: CC0402KRX7R7BB103)
C30  GRM31CR70J226KE19L  [CAPC3216X180N]
C31  Voltage Rating: 10V  Capacitance: 2.2uF  [FP-CGB3B-IPC_A]  (hidden comment: CGB3B3X5R1A225M055AB)
C32  Voltage Rating (DC): 25V  Capacitance: 100nF  [FP-C1005-050-0_05-MFG]  (hidden comment: C1005X5R1E104K050BC)
C33  Capacitance: 10 nF  Voltage Rating: 16 V  [FP-CC0402-MFG]  (hidden comment: CC0402KRX7R7BB103)
C34  Voltage Rating (DC): 25V  Capacitance: 100nF  [FP-C1005-050-0_05-MFG]  (hidden comment: C1005X5R1E104K050BC)
C35  Capacitance: 4.7 nF  Voltage Rating: 16 V  [FP-CC0402-MFG]  (hidden comment: CC0402KRX7R7BB472)
C36  Capacitance: 270 pF  Voltage Rating: 50 V  [FP-C0402-BB-MFG]  (hidden comment: C0402C271K5RACTU)
C37  value 1.8nF  Rated Voltage: 10 V  [CAPC0402(1005)60_N]  (hidden comment: CAP 1.8nF 10V 0402(1005))
C38  Voltage Rating (DC): 25V  Capacitance: 100nF  [FP-C1005-050-0_05-MFG]  (hidden comment: C1005X5R1E104K050BC)
C39  Voltage Rating (DC): 25V  Capacitance: 100nF  [FP-C1005-050-0_05-MFG]  (hidden comment: C1005X5R1E104K050BC)
J1  M50-3530242  [HDRV2W40P0X127_1X2_254X210X420P]
R23  Resistance: 2kR  [FP-CRCW0402-e3-IPC_C]  (hidden comment: CRCW04022K00FKED)
R24  Resistance: 0mR  [FP-MCS0402-MFG]  (hidden comment: MCS04020Z0000ZE000)
R25  Resistance: 1kR  [FP-CRCW0402-e3-MFG]  (hidden comment: CRCW04021K00FKED)
R26  Resistance: 1kR  [FP-CRCW0402-e3-MFG]  (hidden comment: CRCW04021K00FKED)
R27  Resistance: 1 KOhm  [RESC1005X40X25NL05T05]  (hidden comment: ERJ-2RKF1001X)
R28  Resistance: 6.8kR  [FP-ERJ2RK-IPC_B]  (hidden comment: ERJ-2RKF6801X)
R29  Resistance: 68kR  [FP-CRCW0402-e3-IPC_C]  (hidden comment: CRCW040268K0JNED)
R30  Case Code (Imperial): 2512  Resistance: 2R  Power Rating: 1W  [FP-CRCW2512-e3-IPC_A]  (hidden comment: CRCW25122R00FNEG)
R31  Resistance: 1 KOhm  [RESC1005X40X25NL05T05]  (hidden comment: ERJ-2RKF1001X)
R32  Resistance: 27kR  [FP-CRCW0402-e3-IPC_C]  (hidden comment: CRCW040227K0JNED)
R33  Resistance: 10KOhm  [RESC1005X40X25LL05T05]  (hidden comment: ERJ2RKF1002X)
R34  Resistance: 10KOhm  [RESC1005X40X25LL05T05]  (hidden comment: ERJ2RKF1002X)
U5  TS982IDWT  [SOIC127P600X175-9N]  (parts A,B of 2)
U6  AD8572ARZ  [ADI-R-8_M]  (parts A,B of 2)

### Blocks framed on the sheet
3RD ORDER LOW PASS FILTER: C31 C34-C38 R25 R26 R28 R29 R32 U6
CONSTANT CURRENT SOURCE: C29 C32 C33 C39 R27 R31 R33 R34 U5

### Ports
CC_IN, DAC_OP, DR_CFB, DR_OP

### Nets
AGND: C30.2 C32.2 C34.2 C35.2 C36.2 C38.2 C39.2 R34.1 U6.3(+IN_A)
N3V3: C38.1 C39.1 U5.4(VCC-) U5.9(VCC-) U6.4(-V)
P3V3: C32.1 C34.1 U5.8(VCC+) U6.8(+V)
CC_IN: C33.2 R24.1 R27.1 R33.1 R34.2 U5.3(NON_INVERTING_INPUT_1) U6.1(OUT_A) ; port CC_IN
DAC_OP: R28.1 ; port DAC_OP  [project net DAC OP]
DR_CFB: J1.2 R30.2 U5.5(NON_INVERTING_INPUT_2) ; port DR_CFB
DR_OP: C29.1 R30.1 R31.2 U5.1(OUTPUT1) ; port DR_OP
NetC29_2: C29.2 R31.1 R33.2 U5.2(INVERTING_INPUT_1)
NetC30_1: C30.1 J1.1
NetC31_1: C31.1 C37.1 R25.1 U6.7(OUT_B)
NetC31_2: C31.2 R26.1
NetC33_1: C33.1 R27.2 U5.6(INVERTING_INPUT_2) U5.7(OUTPUT2)
NetC35_1: C35.1 R28.2 R29.1
NetC36_1: C36.1 R32.2 U6.5(+IN_B)
NetC37_2: C37.2 R29.2 R32.1
NetR23_1: R23.1 R24.2
NetR23_2: R23.2 R26.2 U6.2(-IN_A)
NetR25_2: R25.2 U6.6(-IN_B)

### Notes on the sheet
- (near R23) INVERTING AMP
- (near C30) DRIVE
- POT TO SET
- DRIVE CURRENT
- SC 1-2 IF DAC
- CONTROLS IT
- BH CONFIDENTIAL
- NOTE
- Title:
- Sheet Title:
- Designed:
- Checked:
- Date:
- DRAWN IN ACCORDANCE WITH TECHNOLOGY WORK INSTRUCTIONS W064
- REV
- DATE
- ECR/ECN
- INT'L
- Number:
- Approved:
- FOR LIMITED NEED TO KNOW USE ONLY. NO PARTS OF THIS DOCUMENT MAY BE PRODUCED OR DISCLOSED WITHOUT PRIOR PERMISSION OF BH
- File:
- Sheet:
- of

### Library data of the parts
C29 C33 = CMP-03422-000501-1: CAP CER 10000PF 16V X7R 0402; Manufacturer: YAGEO; Automotive Grade: NA; Material: Ceramic; Value: 10 nF; Tolerance: 0.1; Temperature Coefficient: 30ppm/°C; Temperature Range Low: -55°C; Temperature Range High: +125°C; Mouser Description: 0402 10 nF 16 V ±10 % Tolerance X7R SMT Multilayer Ceramic Capacitor; Footprint Url: http://www.yageo.com/exep/pages/download/literatures/UPY-C_GEN_24.pdf; Category: Cap; RoHS: TRUE; Manufacturer Part Number: CC0402KRX7R7BB103; ComponentLink2Description: Datasheet; Ipc Land Pattern Name: CAPC10050X50; Automotive: No; ComponentLink2URL: http://www.yageo.com/documents/recent/UPY-GP_NP0_16V-to-50V_16.pdf; Device Class L1: Passive Components; Height: 0.55mm; Temperature Characteristic: X7R; Package: CC0402; Device Class L3: Ceramic Capacitors; Lead Free: Yes; Device Class L2: Capacitors; Digikey Description: CAP CER 10000PF 16V X7R 0402; Octopart: https://octopart.com/cc0402krx7r7bb103-yageo-192895; Temperature: -55°C to +125°C
C30 = GRM31CR70J226KE19L: Murata 1206 GRM 22uF Ceramic Multilayer Capacitor, 6.3 V dc, +125C, X7R Dielectric, +/-10% SMD; Manufacturer_Name: Murata Electronics; Geometry.Height: 1.8mm; Manufacturer_Part_Number: GRM31CR70J226KE19L; Mouser Part Number: 81-GRM31CR70J226KE9L; Mouser Price/Stock: https://www.mouser.co.uk/ProductDetail/Murata-Electronics/GRM31CR70J226KE19L?qs=WYkmdVEdyYbKPyWIkgMm5A%3D%3D; Arrow Part Number: GRM31CR70J226KE19L; Arrow Price/Stock: https://www.arrow.com/en/products/grm31cr70j226ke19l/murata-manufacturing?region=nac; Mouser Testing Part Number: *; Mouser Testing Price/Stock: *; Datasheet Link: https://datasheet.datasheetarchive.com/originals/distributors/Datasheets_SAMA/ec4f1577dddcc7a13ddad897a28002d3.pdf
C31 = CMP-08246-006382-1: as C18 on sheet CE842170260_SHEET2; Max Operating Temperature: 85°C; Length: 1.6mm; Case Code (Imperial): 0603; Termination: SMD/SMT; Weight: 7.1E-05oz; Mount: Surface Mount; Depth: 0.8mm; Packaging: Tape and Reel; RoHS Compliant: Yes; Series: CGB; Voltage Rating (DC): 10V; Dielectric: X5R; Case/Package: 0603; Case Code (Metric): 1608; Height: 0.55mm; Min Operating Temperature: -55°C; Thickness: 0.022inch; Tolerance: 20%; Width: 0.8mm; Package Quantity: 1; Lead Free: Lead Free
C32 C34 C38 C39 = CMP-2000-06000-2: as C16 on sheet CE842170260_SHEET2; Case Code (Imperial): 0402; Termination: Wraparound; Series: C; Depth: 0.5mm; Contact Plating: Tin; Case Code (Metric): 1005; Dielectric: X5R; Case/Package: 0402; Voltage Rating: 25V; Packaging: Tape and Reel; Thickness: 0.022inch; Dielectric Material: Ceramic; Height: 0.5mm; Weight: 2.3E-05oz; RoHS Compliant: Yes; Width: 0.02inch; Tolerance: 10%; Mount: Surface Mount; Package Quantity: 1; Max Operating Temperature: 85°C; Construction: Flat; Min Operating Temperature: -55°C; REACH SVHC: No SVHC; Resistor Type: Ceramic; Length: 1mm; Lead Free: Lead Free; Voltage: 25V
C35 = CMP-1034-01810-2: CAP CER 4700PF 16V X7R 0402; Manufacturer: YAGEO; Automotive Grade: NA; Material: Ceramic; Value: 4.7 nF; Tolerance: 0.1; Temperature Coefficient: 30ppm/°C; Automotive: No; Temperature Range Low: -55°C; Category: Cap; RoHS: TRUE; Footprint Url: http://www.yageo.com/exep/pages/download/literatures/UPY-C_GEN_24.pdf; Device Class L2: Capacitors; Octopart: https://octopart.com/cc0402krx7r7bb472-yageo-44648962; Package: CC0402; Temperature Characteristic: X7R; ComponentLink2Description: Datasheet; ComponentLink2URL: http://www.yageo.com/documents/recent/UPY-GP_NP0_16V-to-50V_16.pdf; Mouser Description: YAGEO (PHYCOMP) - CC0402KRX7R7BB472 - CAP, MLCC, X7R, 4.7NF, 16V, 0402; Device Class L1: Passive Components; Ipc Land Pattern Name: CAPC10050X50; Height: 0.55mm; Device Class L3: Ceramic Capacitors; Manufacturer Part Number: CC0402KRX7R7BB472; Temperature: -55°C to +125°C; Temperature Range High: +125°C; Lead Free: Yes; Digikey Description: CAP CER 4700PF 16V X7R 0402
C36 = CMP-2008-02191-3: CAP CER 270PF 50V 10% X7R 0402; Manufacturer: Kemet; Temperature Coefficient: 15%; Tolerance: 0.1; Material: Ceramic; Device Class L2: Capacitors; Digikey Description: CAP CER 270PF 50V 10% X7R 0402; ComponentLink2Description: Datasheet; Temperature: -55°C to +125°C; Value: 270 pF; Manufacturer Part Number: C0402C271K5RACTU; RoHS: TRUE; Automotive: No; Mouser Description: Multilayer Ceramic Capacitors MLCC - SMD/SMT 50volts 270pF X7R 10%; Category: Cap; Lead Free: Yes; Package: C0402-BB; Device Class L3: Ceramic Capacitors; Octopart: https://octopart.com/c0402c271k5ractu-kemet-5510096; Ipc Land Pattern Name: CAPC10050X50; Device Class L1: Passive Components; Height: 0.55mm; Temperature Characteristic: X7R; Temperature Range High: +125°C; Temperature Range Low: -55°C; ComponentLink2URL: https://content.kemet.com/datasheets/KEM_C1002_X7R_SMD.pdf
C37 = CMP-1034-01698-1: CAP 1.8nF 10V ±5% 0402 (1005 Metric) Thickness 0.6mm SMD; Case-Metric: 1005; Case-EIA: 0402; Tolerance: Â±5%; Max Thickness: 0.6 mm; Technology: SMT
J1 = M50-3530242: Headers & Wire Housings 2 WAY SIL VERT PC TAIL P/HDR; Manufacturer_Name: Harwin; Geometry.Height: 4.2mm; Mouser Part Number: 855-M50-3530242; Mouser Price/Stock: https://www.mouser.co.uk/ProductDetail/Harwin/M50-3530242?qs=%252BdQmOuGyFcFfqfwYQe%2FxZw%3D%3D; Manufacturer_Part_Number: M50-3530242; Datasheet Link: https://cdn.harwin.com/pdfs/M50-353.pdf
R23 = CMP-2002-08446-2: RES Thick Film, 2kΩ, 1%, 0.063W, 100ppm/°C, 0402; Max Power Dissipation: 63mW; Voltage Rating: 50V; Contact Plating: Tin; Tolerance: 1%; Weight: 2.3E-05oz; Mount: Surface Mount; Length: 1mm; Case Code (Metric): 1005; Number of Pins: 2; Depth: 0.5mm; Power Rating: 63mW; Packaging: Tape and Reel; Case/Package: 0402; Max Operating Temperature: 155°C; Width: 0.5mm; Package Quantity: 10; Case Code (Imperial): 0402; Features: Automotive AEC-Q200; Number of Terminations: 2; Lead Free: Lead Free; Composition: Thick Film; Termination: SMD/SMT; Min Operating Temperature: -55°C; Radiation Hardening: No; Military Standard: Not; Height: 0.35mm; Voltage Rating (DC): 50V; Temperature Coefficient: 100ppm/°C
R24 = CMP-02407-001042-1: RES SMD 1.2K OHM 1% 1/10W 0402; Voltage Rating: 50V; Max Power Dissipation: 100mW; Composition: Thin Film; Max Operating Temperature: 125°C; Number of Terminations: 2; Mount: Surface Mount; Packaging: Tape and Reel; REACH SVHC: No SVHC; Case Code (Metric): 1005; Package Quantity: 1; Radiation Hardening: No; Termination: Wraparound; Case Code (Imperial): 0402; Contact Plating: Tin; Depth: 0.5mm; Height: 0.015inch; Length: 1mm; Voltage Rating (DC): 50V; Power Rating: 100mW; Lead Free: Lead Free; Min Operating Temperature: -55°C; Military Standard: Not; Width: 0.02inch; Case/Package: 0402
R25 R26 = CMP-2002-08276-2: RES Thick Film, 1kΩ, 1%, 0.063W, 100ppm/°C, 0402; Power Rating: 63mW; Voltage Rating (DC): 50V; Package Quantity: 10; Termination: SMD/SMT; Width: 0.5mm; Military Standard: Not; Length: 1mm; Contact Plating: Tin; Mount: Surface Mount; Packaging: Tape and Reel; Case Code (Imperial): 0402; Tolerance: 1%; Weight: 2.3E-05oz; Number of Pins: 2; Case/Package: 0402; Case Code (Metric): 1005; Lead Free: Lead Free; Number of Terminations: 2; Max Power Dissipation: 63mW; Depth: 0.5mm; Temperature Coefficient: 100ppm/°C; Max Operating Temperature: 155°C; Height: 0.35mm; Features: Automotive AEC-Q200; Composition: Thick Film; Radiation Hardening: No; Voltage Rating: 50V; Min Operating Temperature: -55°C
R27 R31 = CMP-1011-00510-4: Chip Resistor, 1 KOhm, +/- 1%, 100 mW, -55 to 155 degC, 0402 (1005 Metric), RoHS, Tape and Reel; Manufacturer: Basic Passives; Voltage Rating: 50 V; Case\/Package: 0402; Power Rating: 100 mW; PartNumber: ERJ-2RKF1001X; DatasheetVersion: 04/2015; Radiation Hardening: No; Pins: 2; Height: 0.35 mm; RoHSCompliant: true; Case Code (Imperial): 0402; ComponentLink2Description: Datasheet; ComponentLink1Description: Manufacturer URL; PackageReference: 0402; Mount: Surface Mount; Package Quantity: 10000; Tolerance: 1%; ComponentLink1URL: http://www.panasonic.com/; PackageDescription: 2-Pin Surface Mount Device, Body 1 x 0.5 mm; Mounting Technology: Surface Mount; Case Code (Metric): 1005; ComponentLink2URL: http://industrial.panasonic.com/cdbs/www-data/pdf/RDA0000/AOA0000C86.pdf; REACH SVHC: Yes; Packaging: Tape and Reel; Max Operating Temperature: 155 degC; Min Operating Temperature: -55 degC; Width: 0.5 mm; Length: 1 mm
R28 = CMP-1011-00604-3: RES SMD 6.8K OHM 1% 1/10W 0402; Voltage Rating: 50V; Power Rating: 100mW; Temperature Coefficient: 100ppm/°C; Min Operating Temperature: -55°C; Max Operating Temperature: 155°C; Number of Terminations: 2; Max Power Dissipation: 100mW; Military Standard: Not; Package Quantity: 1; Depth: 0.5mm; Contact Plating: Tin; Case Code (Imperial): 0402; Number of Pins: 2; Tolerance: 1%; Height: 0.35mm; Case/Package: 0402; Composition: Thick Film; Width: 0.5mm; Packaging: Tape and Reel; Mount: Surface Mount; Radiation Hardening: No; REACH SVHC: No SVHC; Features: Automotive AEC-Q200; Voltage Rating (DC): 50V; Length: 1mm; Case Code (Metric): 1005; Termination: SMD/SMT; Lead Free: Lead Free
R29 = CMP-2002-00171-2: RES Thick Film, 68kΩ, 5%, 0.063W, 200ppm/°C, 0402; Power Rating: 63mW; Voltage Rating (DC): 50V; Case Code (Imperial): 0402; Max Operating Temperature: 155°C; Case Code (Metric): 1005; Contact Plating: Tin; Composition: Thick Film; Radiation Hardening: No; Case/Package: 0402; Height: 0.016inch; Weight: 2.3E-05oz; Termination: SMD/SMT; Tolerance: 5%; Package Quantity: 1; Temperature Coefficient: 200ppm/°C; Lead Free: Lead Free; Features: Automotive AEC-Q200; Min Operating Temperature: -55°C; Number of Terminations: 2; Depth: 0.5mm; Packaging: Tape and Reel; Voltage Rating: 50V; Width: 0.5mm; Military Standard: Not; Length: 1mm; Number of Pins: 2; Max Power Dissipation: 63mW
R30 = CMP-02407-003108-1: RES Thick Film, 2Ω, 1%, 1W, 200ppm/°C, 2512; Voltage Rating: 500V; Temperature Coefficient: 73ppm/°C; Max Operating Temperature: 155°C; Case Code (Metric): 6432; Termination: SMD/SMT; Length: 6.3mm; Width: 3.15mm; Voltage Rating (DC): 500V; Packaging: Tape and Reel; Depth: 3.15mm; Weight: 0.001429oz; Lead Free: Lead Free; Composition: Thick Film; Min Operating Temperature: -55°C; Package Quantity: 2000; Number of Pins: 2; Height: 0.6mm; Tolerance: 1%; Case/Package: 2512
R32 = CMP-1011-00108-3: RES Thick Film, 27kΩ, 5%, 0.063W, 200ppm/°C, 0402; Voltage Rating: 50V; Max Power Dissipation: 63mW; Packaging: Tape and Reel; Case/Package: 0402; Width: 0.5mm; Min Operating Temperature: -55°C; Number of Terminations: 2; Military Standard: Not; Radiation Hardening: No; Mount: Surface Mount; Voltage Rating (DC): 50V; Weight: 2.3E-05oz; Package Quantity: 1; Tolerance: 5%; Height: 0.016inch; Contact Plating: Tin; Temperature Coefficient: 200ppm/°C; Termination: SMD/SMT; Max Operating Temperature: 155°C; Power Rating: 63mW; Features: Automotive AEC-Q200; Lead Free: Lead Free; Case Code (Imperial): 0402; Composition: Thick Film; Length: 1mm; Case Code (Metric): 1005; Number of Pins: 2; Depth: 0.5mm
R33 R34 = CMP-2000-07588-1: Chip Resistor, 10 KOhm, +/- 1%, 0.1 W, -55 to 155 degC, 0402 (1005 Metric), RoHS, Tape and Reel; Manufacturer: Panasonic; Power Rating: 100mW; Voltage Rating: 50V; Case\/Package: 0402; Temperature Coefficient: 100ppm\/degreesC; RoHSCompliant: True; Lead Free: LeadFree; Package Quantity: 1; Contact Plating: Tin; Length: 1mm; Radiation Hardening: No; REACH SVHC: NoSVHC; Max Operating Temperature: 155degC; Depth: 0.5mm; Case Code (Imperial): 0402; Military Standard: Not; Package Description: 2-Pin Surface Mount Device, Body 1 x 0.5 mm; Termination: SMD/SMT; Case Code (Metric): 1005; Height: 0.35mm; Packaging: TapeandReel; Voltage Rating (DC): 50V; Package Reference: 402; Number of Pins: 2; Tolerance: 1%; Mounting Technology: SurfaceMount; Width: 0.02inch; Mount: SurfaceMount; Datasheet URL: https://industrial.panasonic.com/cdbs/www-data/pdf/RDA0000/AOA0000C304.pdf; Composition: ThickFilm; Datasheet Version: 02/2017; Manufacturer URL: http://www.panasonic.com/; Max Power Dissipation: 100mW; Number of Terminations: 2; Min Operating Temperature: -55degC
U6 = CMP-0384-00919-1: Double Channel Rail-to-Rail Operational Amplifier, 1.5 MHz BW, 400 mV/us SR, Industrial, 8-pin SOIC (R-8), Tube; Manufacturer: Analog Devices; Generic Part Number: AD8572; Amplifiers Per Package: 2; Iq/Amp: 975uA; Input Offset Voltage: 1uV; Small Signal Bandwidth: 1.5MHz; Input Bias Current: 10pA; V Span Min: 2.7V; V Span Max: 6V; PackageVersion: 060506-A; ComponentLink1Description: Manufacturer URL; Code_JEDEC: MS-012-AA; PackageReference: R-8; ComponentLink1URL: http://www.analog.com/en/index.html; Mounting Technology: Surface Mount; ComponentLink2Description: Datasheet; Slew Rate: 400mV/us; ComponentLink3Description: Package Specification; DatasheetVersion: Rev. E; ComponentLink2URL: http://www.analog.com/static/imported-files/data_sheets/AD8571_8572_8574.pdf; PartNumber: AD8572ARZ; PackageDescription: 8-Pin Standard Small Outline Package, Body 3.9 x 4.9 mm, Pitch 1.27 mm; ComponentLink3URL: http://www.analog.com/static/imported-files/packages/PKG_PDF/SOIC_Narrow%20(R)/R_8.pdf
U5 = TS982IDWT: Package: None; Price: None; Value: *; MP: TS982IDWT; Availability: Unavailable